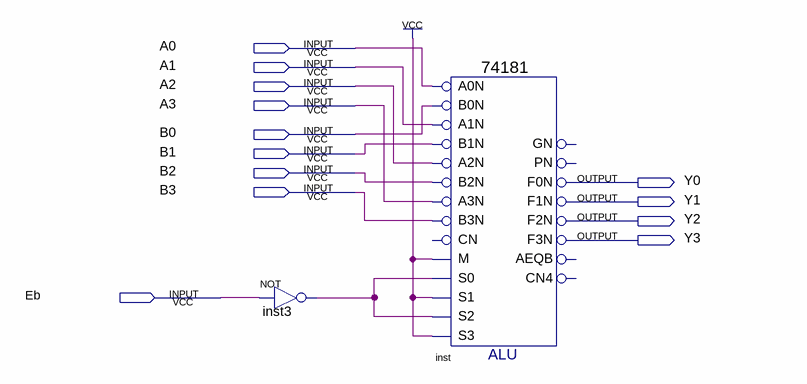
[diagram p0: schematic sheet]
// Quartus schematic 4bits_overriter.bdf as structural Verilog: 2 symbols, 13 pins
module \4bits_overriter  (
  input  A0,
  input  A1,
  input  A2,
  input  A3,
  input  B0,
  input  B1,
  input  B2,
  input  B3,
  input  Eb,
  output Y0,
  output Y1,
  output Y2,
  output Y3
);

  wire inst3_out;

  not inst3 (inst3_out, Eb);
  \74181  inst (
    .B0N(B0), .A0N(A0), .A1N(A1), .B1N(B1), .A3N(A3), .B2N(B2), .A2N(A2), .M(1'b1), .B3N(B3), .S2(inst3_out),
    .S1(1'b1), .S0(inst3_out), .S3(1'b1), .F3N(Y3), .F1N(Y1), .F0N(Y0), .F2N(Y2));  // open: CN, PN, GN, AEQB, CN4
endmodule
